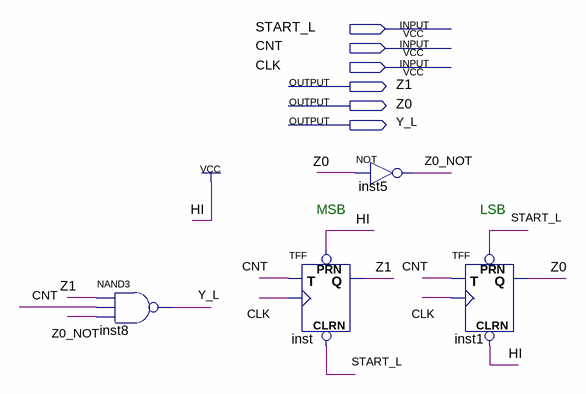
[diagram p0: schematic sheet]
// Quartus schematic Practical1.bdf as structural Verilog: 4 symbols, 6 pins
module Practical1 (
  input  START_L,
  input  CNT,
  input  CLK,
  output Z1,
  output Z0,
  output Y_L
);

  wire Z0_NOT;

  nand inst8 (Y_L, Z1, CNT, Z0_NOT);
  TFF inst (.PRN(1'b1), .CLRN(START_L), .T(CNT), .CLK(CLK), .Q(Z1));
  not inst5 (Z0_NOT, Z0);
  TFF inst1 (.PRN(START_L), .CLRN(1'b1), .T(CNT), .CLK(CLK), .Q(Z0));

  // Notes on the sheet:
  //   MSB
  //   LSB
endmodule
